# Altium schematic sheet HX711.SchDoc
size A4
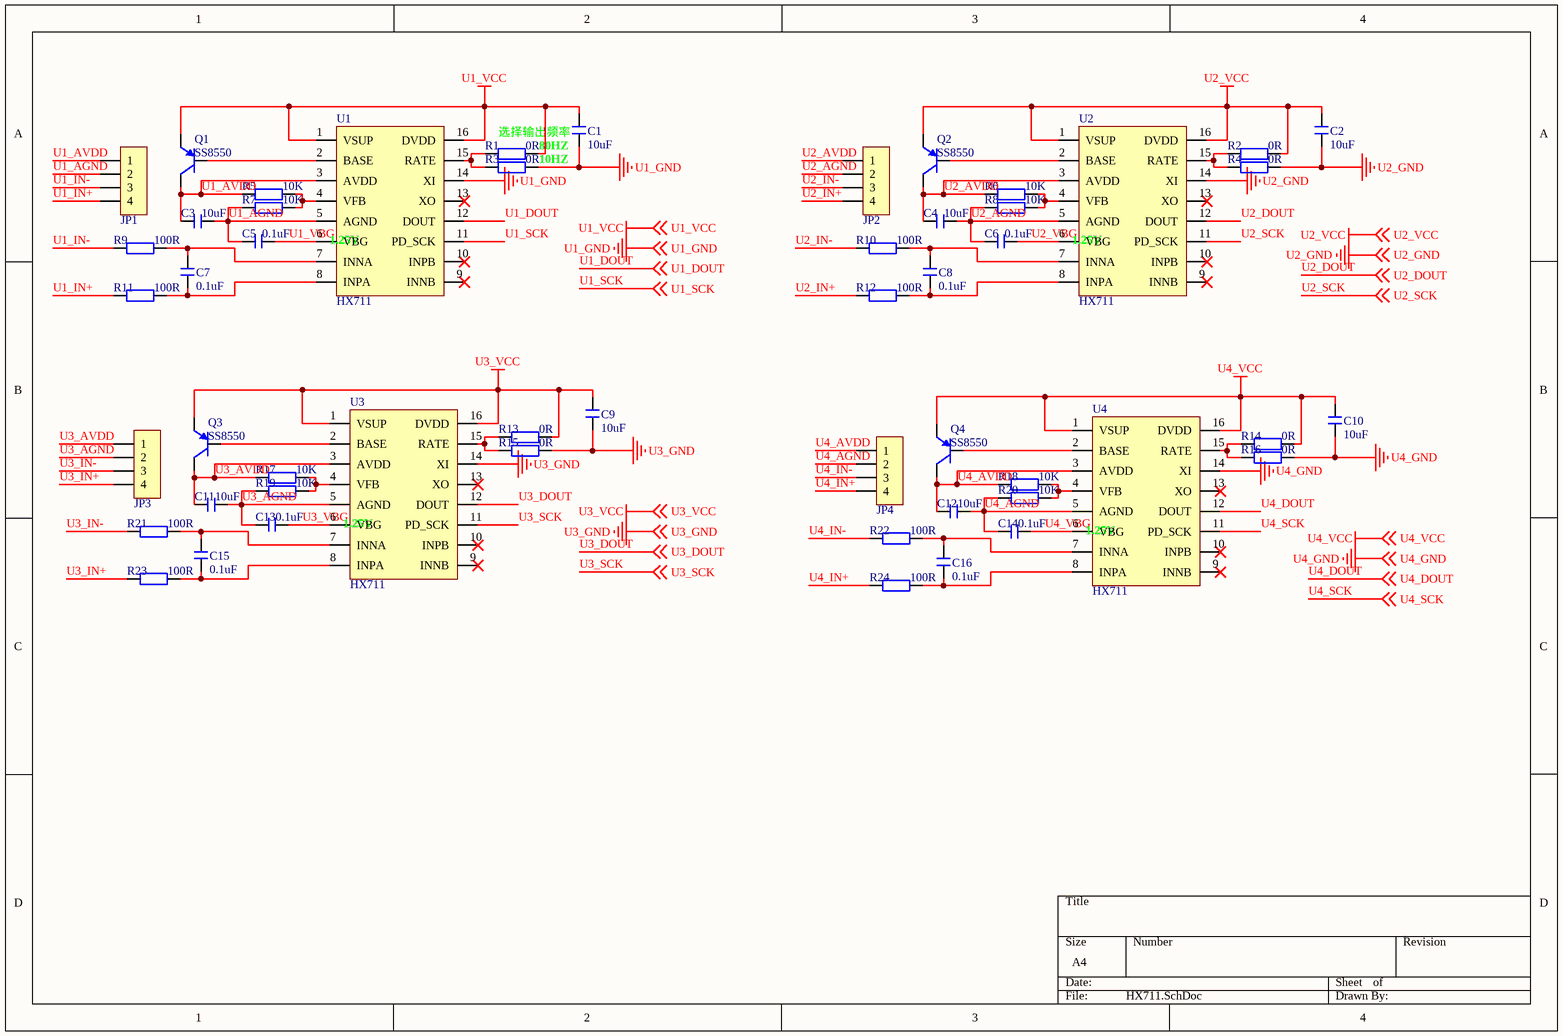
[diagram p0: HX711.SchDoc]

## Parts
C1  10uF  [C 0603_L]
C2  10uF  [C 0603_L]
C3  10uF  [C 0603_L]
C4  10uF  [C 0603_L]
C5  0.1uF  [C 0603_L]
C6  0.1uF  [C 0603_L]
C7  0.1uF  [C 0603_L]
C8  0.1uF  [C 0603_L]
C9  10uF  [C 0603_L]
C10  10uF  [C 0603_L]
C11  10uF  [C 0603_L]
C12  10uF  [C 0603_L]
C13  0.1uF  [C 0603_L]
C14  0.1uF  [C 0603_L]
C15  0.1uF  [C 0603_L]
C16  0.1uF  [C 0603_L]
JP1  HDR-1X4  [MX 1.25-WS-4P]  (value not drawn)
JP2  HDR-1X4  [MX 1.25-WS-4P]  (value not drawn)
JP3  HDR-1X4  [MX 1.25-WS-4P]  (value not drawn)
JP4  HDR-1X4  [MX 1.25-WS-4P]  (value not drawn)
Q1  SS8550  [SOT23-3N]
Q2  SS8550  [SOT23-3N]
Q3  SS8550  [SOT23-3N]
Q4  SS8550  [SOT23-3N]
R1  0R  [R 0603_L]
R2  0R  [R 0603_L]
R3  0R  [R 0603_L]
R4  0R  [R 0603_L]
R5  10K  [R 0603_L]
R6  10K  [R 0603_L]
R7  10K  [R 0603_L]
R8  10K  [R 0603_L]
R9  100R  [R 0603_L]
R10  100R  [R 0603_L]
R11  100R  [R 0603_L]
R12  100R  [R 0603_L]
R13  0R  [R 0603_L]
R14  0R  [R 0603_L]
R15  0R  [R 0603_L]
R16  0R  [R 0603_L]
R17  10K  [R 0603_L]
R18  10K  [R 0603_L]
R19  10K  [R 0603_L]
R20  10K  [R 0603_L]
R21  100R  [R 0603_L]
R22  100R  [R 0603_L]
R23  100R  [R 0603_L]
R24  100R  [R 0603_L]
U1  HX711  [SOP16_L]
U2  HX711  [SOP16_L]
U3  HX711  [SOP16_L]
U4  HX711  [SOP16_L]

## Nets
U1_GND: C1.2 R3.2 U1.14(XI) ; off-sheet U1_GND
U1_VCC: C1.1 Q1.2(E) R1.2 U1.1(VSUP) U1.16(DVDD) ; off-sheet U1_VCC
U2_GND: C2.2 R4.2 U2.14(XI) ; off-sheet U2_GND
U2_VCC: C2.1 Q2.2(E) R2.2 U2.1(VSUP) U2.16(DVDD) ; off-sheet U2_VCC
U3_GND: C9.2 R15.2 U3.14(XI) ; off-sheet U3_GND
U3_VCC: C9.1 Q3.2(E) R13.2 U3.1(VSUP) U3.16(DVDD) ; off-sheet U3_VCC
U4_GND: C10.2 R16.2 U4.14(XI) ; off-sheet U4_GND
U4_VCC: C10.1 Q4.2(E) R14.2 U4.1(VSUP) U4.16(DVDD) ; off-sheet U4_VCC
U1_AGND: C3.1 C5.2 JP1.2 R7.1 U1.5(AGND)
U1_AVDD: C3.2 JP1.1 Q1.3(C) R5.1 U1.3(AVDD)
U1_DOUT: U1.12(DOUT) ; off-sheet U1_DOUT
U1_IN+: JP1.4 R11.1
U1_IN-: JP1.3 R9.1
U1_SCK: U1.11(PD_SCK) ; off-sheet U1_SCK
U1_VBG: C5.1 U1.6(VBG)
U2_AGND: C4.1 C6.2 JP2.2 R8.1 U2.5(AGND)
U2_AVDD: C4.2 JP2.1 Q2.3(C) R6.1 U2.3(AVDD)
U2_DOUT: U2.12(DOUT) ; off-sheet U2_DOUT
U2_IN+: JP2.4 R12.1
U2_IN-: JP2.3 R10.1
U2_SCK: U2.11(PD_SCK) ; off-sheet U2_SCK
U2_VBG: C6.1 U2.6(VBG)
U3_AGND: C11.1 C13.2 JP3.2 R19.1 U3.5(AGND)
U3_AVDD: C11.2 JP3.1 Q3.3(C) R17.1 U3.3(AVDD)
U3_DOUT: U3.12(DOUT) ; off-sheet U3_DOUT
U3_IN+: JP3.4 R23.1
U3_IN-: JP3.3 R21.1
U3_SCK: U3.11(PD_SCK) ; off-sheet U3_SCK
U3_VBG: C13.1 U3.6(VBG)
U4_AGND: C12.1 C14.2 JP4.2 R20.1 U4.5(AGND)
U4_AVDD: C12.2 JP4.1 Q4.3(C) R18.1 U4.3(AVDD)
U4_DOUT: U4.12(DOUT) ; off-sheet U4_DOUT
U4_IN+: JP4.4 R24.1
U4_IN-: JP4.3 R22.1
U4_SCK: U4.11(PD_SCK) ; off-sheet U4_SCK
U4_VBG: C14.1 U4.6(VBG)
NetC7_1: C7.1 R9.2 U1.7(INNA)
NetC7_2: C7.2 R11.2 U1.8(INPA)
NetC8_1: C8.1 R10.2 U2.7(INNA)
NetC8_2: C8.2 R12.2 U2.8(INPA)
NetC15_1: C15.1 R21.2 U3.7(INNA)
NetC15_2: C15.2 R23.2 U3.8(INPA)
NetC16_1: C16.1 R22.2 U4.7(INNA)
NetC16_2: C16.2 R24.2 U4.8(INPA)
NetQ1_1: Q1.1(B) U1.2(BASE)
NetQ2_1: Q2.1(B) U2.2(BASE)
NetQ3_1: Q3.1(B) U3.2(BASE)
NetQ4_1: Q4.1(B) U4.2(BASE)
NetR1_1: R1.1 R3.1 U1.15(RATE)
NetR2_1: R2.1 R4.1 U2.15(RATE)
NetR5_2: R5.2 R7.2 U1.4(VFB)
NetR6_2: R6.2 R8.2 U2.4(VFB)
NetR13_1: R13.1 R15.1 U3.15(RATE)
NetR14_1: R14.1 R16.1 U4.15(RATE)
NetR17_2: R17.2 R19.2 U3.4(VFB)
NetR18_2: R18.2 R20.2 U4.4(VFB)

Not connected (* = marked no-connect by the designer): U1 9(INNB)* 10(INPB)* 13(XO)*; U2 9(INNB)* 10(INPB)* 13(XO)*; U3 9(INNB)* 10(INPB)* 13(XO)*; U4 9(INNB)* 10(INPB)* 13(XO)*

## Notes on the sheet
- (near R1) 选择输出频率
- 80HZ
- 10HZ
- (near U1) 1.25V
- (near U2) 1.25V
- (near U3) 1.25V
- (near U4) 1.25V

## Library data of the parts
C1-C16 = C: 贴片电容
JP1-JP4 = Header 4: 4P接插件
Q1-Q4 = 8550-SMD: 高频放大-PNP型
R1-R24 = R: 贴片电阻